# EAGLE design UP-PAR-Adaptor (EAGLE 9.5.2)
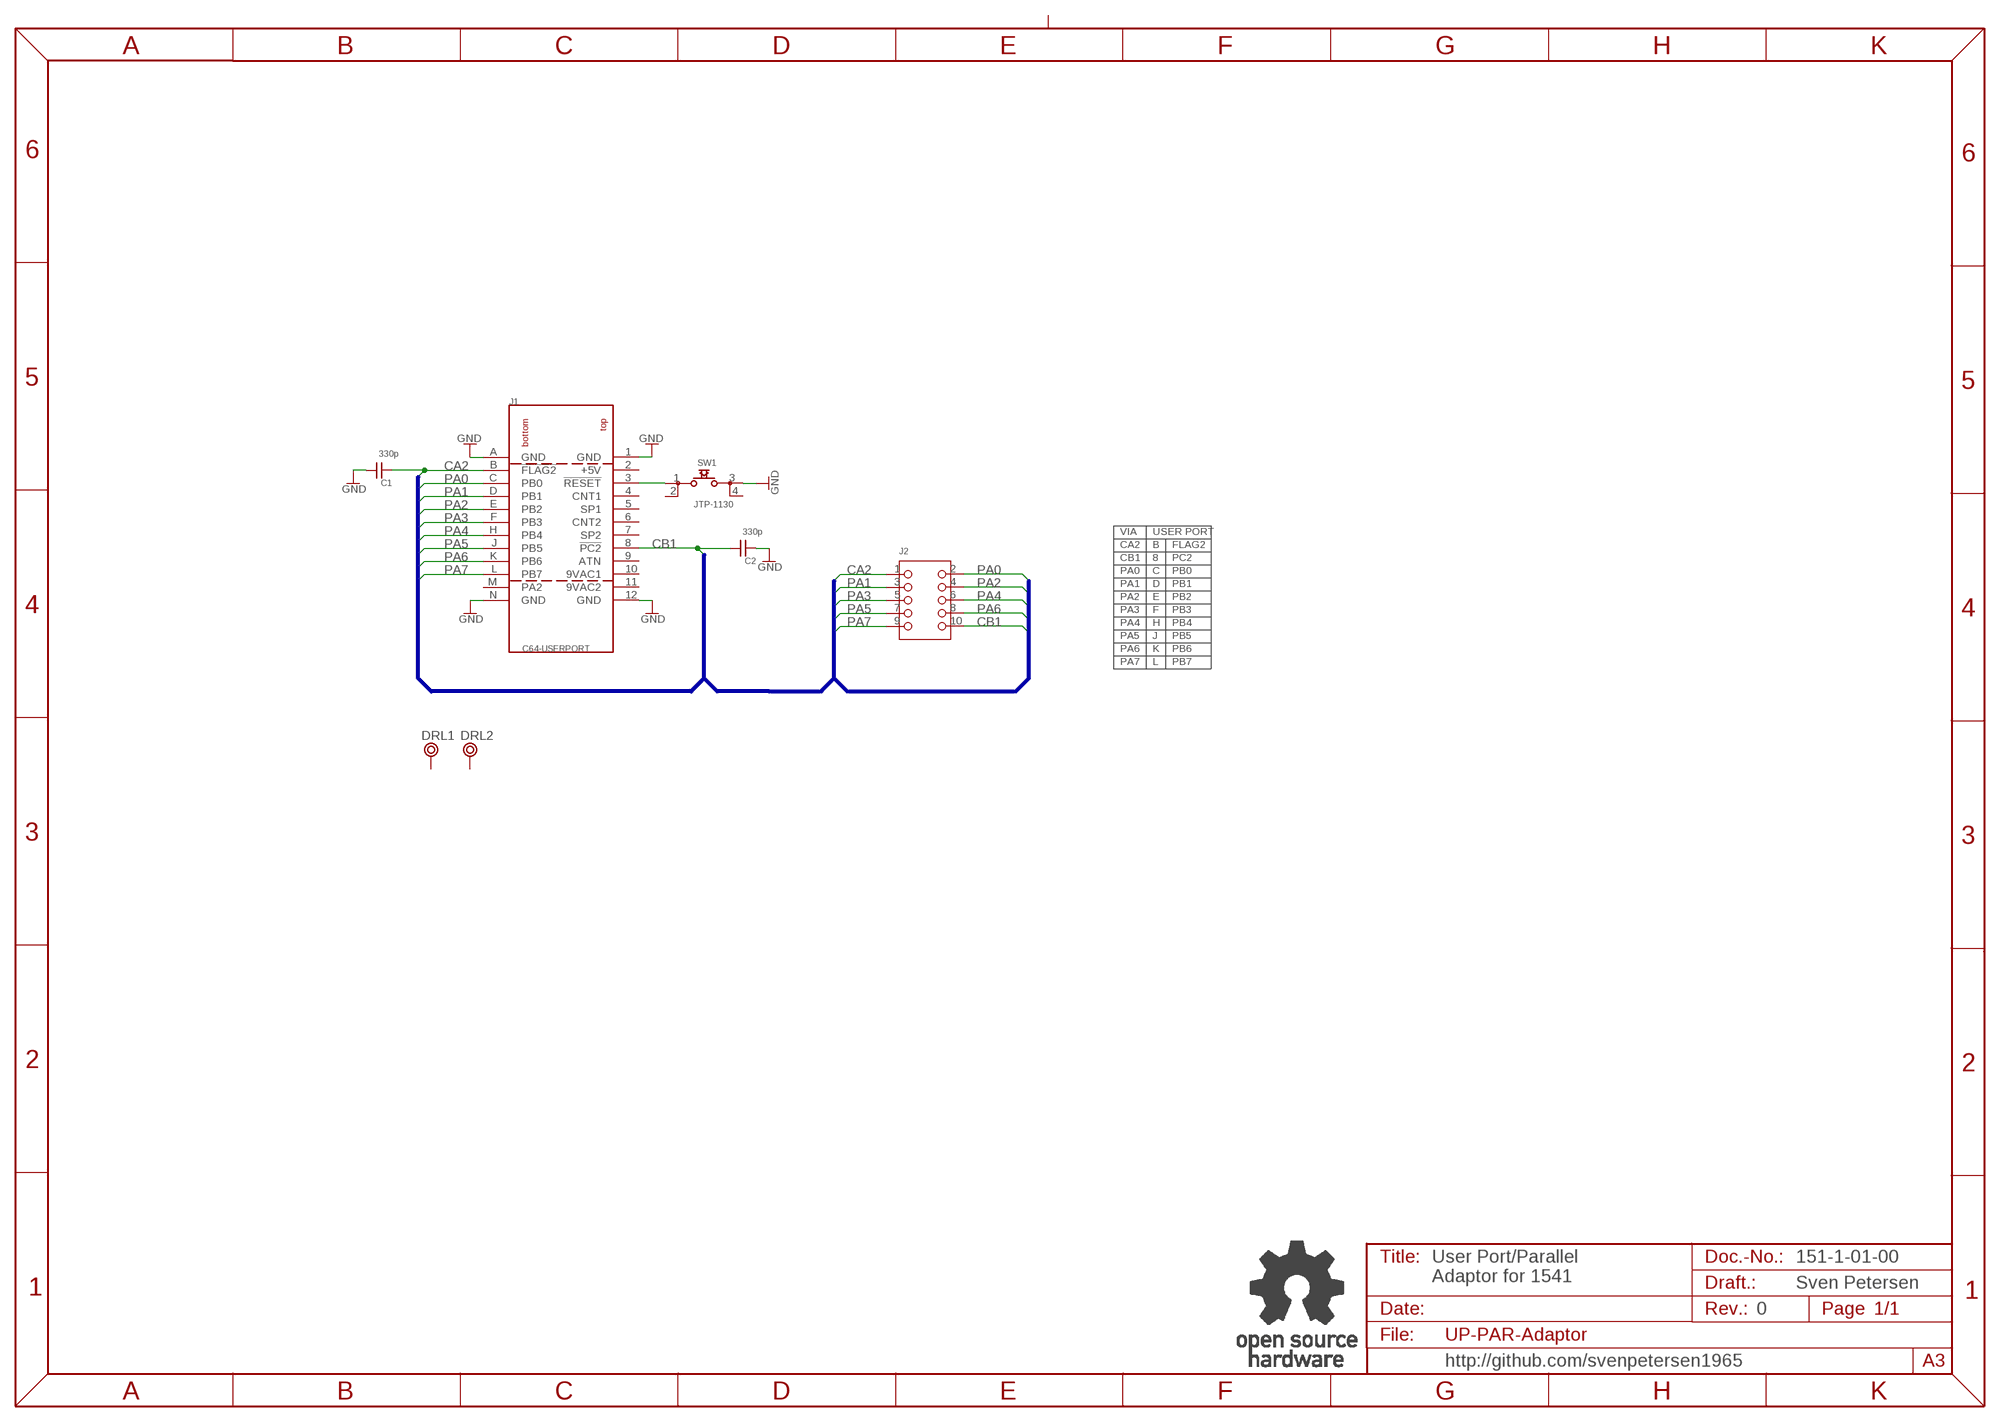
[diagram p0: schematic, sheet 1]

## Parts
C1  330p  CAP01  [C-2,5]
C2  330p  CAP01  [C-2,5]
DRL1  BOHR3,5  [BOHR3,5]
DRL2  BOHR3,5  [BOHR3,5]
J1  C64-USERPORT  [USERPORT]
J2  2X05WV  [2X05WV]
SW1  JTP-1130  [JTP-1130]
U$13  OPEN_SOURCE_HW  [OPENHW]

## Nets
CA2: C1.1 J1.B(!FLAG2) J2.1
CB1: C2.2 J1.8(!PC2) J2.10
GND: C1.2 C2.1 J1.1(GND) J1.12(GND) J1.A(GND) J1.N(GND) SW1.3
N$1: J1.3(!RESET) SW1.1
PA0: J1.C(PB0) J2.2
PA1: J1.D(PB1) J2.3
PA2: J1.E(PB2) J2.4
PA3: J1.F(PB3) J2.5
PA4: J1.H(PB4) J2.6
PA5: J1.J(PB5) J2.7
PA6: J1.K(PB6) J2.8
PA7: J1.L(PB7) J2.9
Unconnected: DRL1.P$1 DRL2.P$1 J1.4(CNT1) J1.5(SP1) J1.6(CNT2) J1.7(SP2) J1.9(ATN) J1.M(PA2) SW1.2 SW1.4

## Buses
VIA:CA[1..2],CB[1..2],CS1,!CS2,D[0..7],!IRQ,PA[0..7],PB[0..7],PHI2,!RES,RS[0..3],R/W

## Notes on the sheet
- VIA | USER PORT
- CA2 | B | !FLAG2
- CB1 | 8 | !PC2
- PA0 | C | PB0
- PA1 | D | PB1
- PA2 | E | PB2
- PA3 | F | PB3
- PA4 | H | PB4
- PA5 | J | PB5
- PA6 | K | PB6
- PA7 | L | PB7
- 151-1-01-00
- User Port/Parallel
  Adaptor for 1541
- Sven Petersen
- 0
- http://github.com/svenpetersen1965

## Power pins joined to a net without a drawn wire
9VAC1: J1.10(9VAC1)
9VAC2: J1.11(9VAC2)
+5V: J1.2(+5V)

## Library data of the parts
C1 C2 = DISCRETE:CAP01
DRL1 DRL2 = Mech_Bohr:BOHR3,5
J1 = Commodore:C64-USERPORT
J2 = PINHEAD:2X05WV
SW1 = Namae_Electronics:JTP-1130
U$13 = Logo:OPEN_SOURCE_HW

## Board
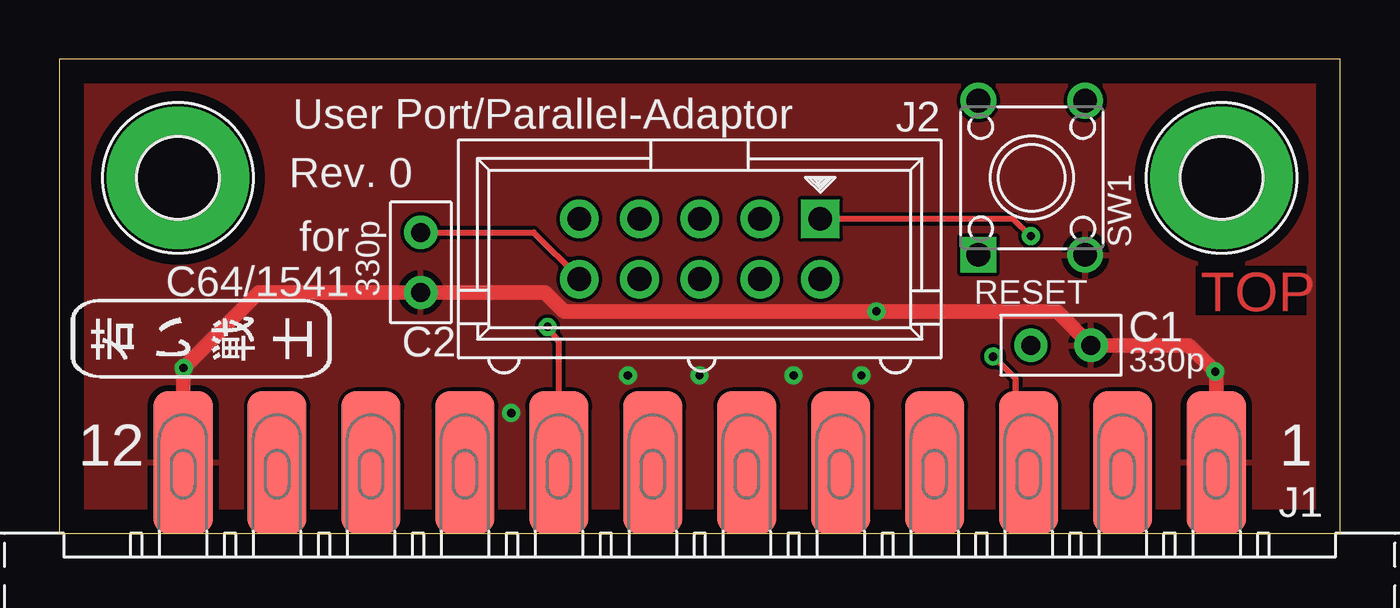
[diagram p1: board, top side]
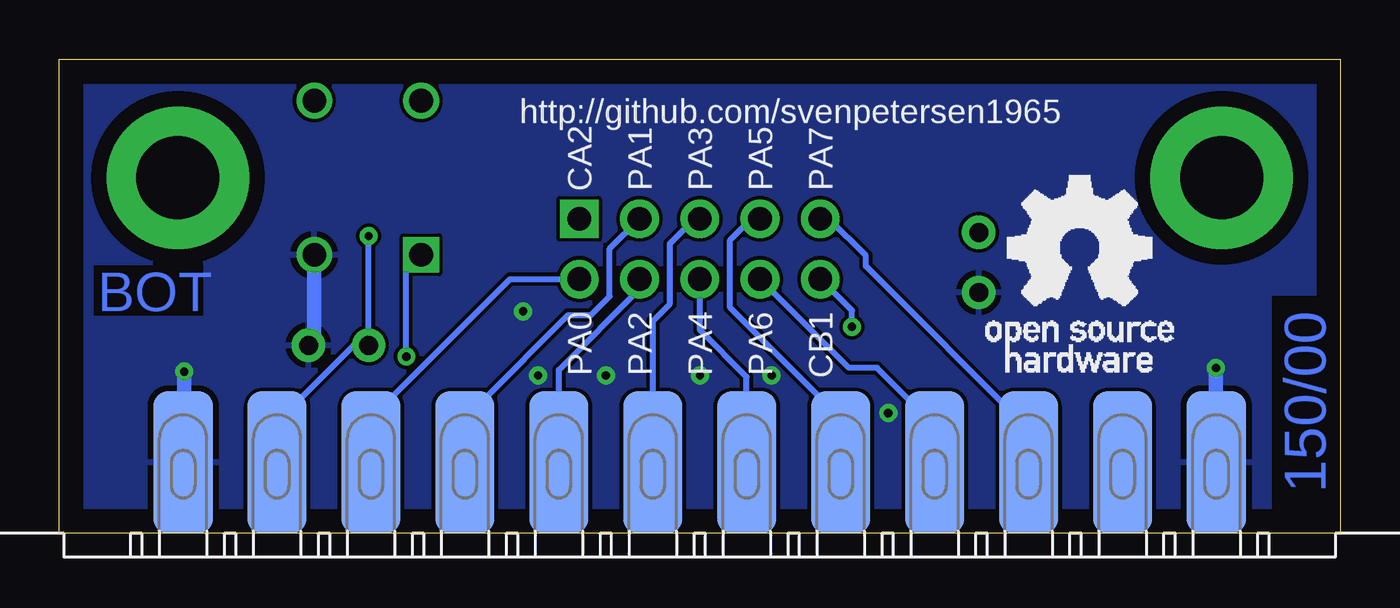
[diagram p2: board, bottom side, seen from below]

Size 54 x 20 mm. Coordinates in mm from the lower left corner, seen from the top.
Outline: 0,0 54,0 54,20 0,20 0,0
Copper layers (1*16): Top 0.035mm / dielectric 1.5mm / Bottom 0.035mm
Design rules "default *": minimum track width 6mil, minimum drill 0.35mm, track to track 6mil, track to pad 6mil, pad to pad 6mil, via to via 6mil, smd to smd 6mil, copper to edge 40mil, drill to drill 6mil, minimum pad ring 10mil, minimum via ring 8mil, stop-mask expansion 4mil, vias tented up to drill 25mil, thermal gap 10mil
bRestrict: 2 lines

### Footprints (pad centres in the part's own frame; a part is rotated, then mirrored left to right if it is on the bottom)
C-2,5 = drill 0.8 pad 1.397: 1 -1.27,0; 2 1.27,0
BOHR3,5 = drill 3.5 pad 6: P$1 0,0
USERPORT = smd 2.5 x 6: 1 -21.78,-3; 2 -17.82,-3; 3 -13.86,-3; 4 -9.9,-3; 5 -5.94,-3; 6 -1.98,-3; 7 1.98,-3; 8 5.94,-3; 9 9.9,-3; 10 13.86,-3; 11 17.82,-3; 12 21.78,-3 | smd 2.5 x 6 bottom: A -21.78,-3; B -17.82,-3; C -13.86,-3; D -9.9,-3; E -5.94,-3; F -1.98,-3; H 1.98,-3; J 5.94,-3; K 9.9,-3; L 13.86,-3; M 17.82,-3; N 21.78,-3
2X05WV = drill 1 pad 1.626 square: 1 -5.08,-1.27 | drill 1 pad 1.626: 2 -5.08,1.27; 3 -2.54,-1.27; 4 -2.54,1.27; 5 0,-1.27; 6 0,1.27; 7 2.54,-1.27; 8 2.54,1.27; 9 5.08,-1.27; 10 5.08,1.27
JTP-1130 = drill 1 square: 1 3.25,-2.25 | drill 1: 2 -3.25,-2.25; 3 3.25,2.25; 4 -3.25,2.25

### Placement (x,y rotation side)
C1  42.23,7.94 0 top
C2  15.24,11.43 90 top
DRL1  5,15 0 top
DRL2  49,15 0 top
J1  27,0 180 top
J2  27,12 180 top
SW1  41,15 270 top
U$8  [2LAYER]  48.1,9.37 0 top
U$9  [PCB-TITLE/]  0.16,27.94 0 top  (outside the outline)
U$10  [SVEN_TAG]  5.87,8.26 90 top
U$13  14.92,6.83 0 bottom

### Tracks (layer width: path | path; a pad name or v marks a point on that pad's centre or on a via)
CA2  (via drill 0.35)
  Top 0.254: v40.96,12.54 40.23,13.27 J2.1
  Bottom 0.254: J1.B 43.97,3.85 43.97,5.56 41.59,7.94 C1.1 v40.96,12.54
CB1  (via drill 0.35)
  Top 0.254: v20.58,8.71 21.06,8.08 J1.8 | C2.2 20,12.7 21.9,10.79 21.91,10.79 J2.10
  Bottom 0.254: v20.58,8.71 20.58,9.39 J2.10
GND  (via drill 0.35)
  Top 0.61: J1.12 5.22,6.97 v5.24,6.99 8.41,10.16 C2.1 20.48,10.16 21.27,9.37 v34.45,9.37 42.07,9.37 C1.2 47.62,7.94 48.78,6.78 | J1.A 48.78,6.78 | 48.78,6.78 v48.74,6.83
  Bottom 0.61: v5.24,6.99 5.24,3.02 J1.12 | v48.74,6.83 48.74,3.04 J1.A | C1.2 43.25,8.19 SW1.3
  other vias: 30.96,6.67 33.81,6.67 26.99,6.67 23.97,6.67 19.05,5.08
  pour Top: 0.79,19.05 53.02,19.05 53.02,0.79 0.79,0.79
  pour Bottom: 0.79,19.05 53.02,19.05 53.02,0.79 0.79,0.79
N$1  (via drill 0.35)
  Top 0.254: J1.3 40.32,3.54 40.32,6.51 v39.37,7.46
  Bottom 0.254: v39.37,7.46 39.37,11.13 SW1.1
PA0
  Bottom 0.152: 40.32,5.4 40.86,4.86 J1.C
  Bottom 0.254: 40.32,5.4 34.99,10.73 J2.2
PA1
  Bottom 0.254: J1.D 36.2,3.71 36.2,5.56 32.54,9.21 31.59,9.21 30.8,10 30.8,12.01 J2.3
PA2
  Bottom 0.254: J1.E 32.94,6.91 29.54,10.31 J2.4
PA3
  Bottom 0.254: J1.F 28.98,8.96 28.26,9.68 28.26,12.22 27.21,13.27 J2.5
PA4
  Bottom 0.254: J1.H 25.02,6.61 27,8.59 J2.6
PA5
  Bottom 0.254: 21.06,4.87 J1.J 21.06,4.87 | J2.7 24.83,13.27 25.72,12.38 25.72,9.53 21.06,4.87
PA6
  Bottom 0.254: J1.K 17.1,4.56 19.53,6.99 20.71,6.99 J2.8
PA7
  Bottom 0.254: J1.L 13.14,4.41 20,11.27 20,11.72 21.55,13.27 J2.9

### Text on the board
Bottom: 150/00
tPlace: User Port/Parallel-Adaptor | Rev. 0 | for / C64/1541 | 330p | RESET | 330p | 12 | 1
bPlace: http://github.com/svenpetersen1965 | PA7 | PA5 | PA3 | PA1 | CA2 | CB1 | PA6 | PA4 | PA2 | PA0
Document: 150-2-01-00 | Sven Petersen / 2020 | 35µm | 2 | 0